# Altium schematic sheet TopLevel.SchDoc: Titel
size A3; ApprovedBy: name; CompanyName: DCI Electronics bv; DrawnBy: KRS; Address1: Nijverheidsstraat 14; Address2: 4458 AV Eindewege; Address3: Phone: +31 (0)113 344880; DocumentNumber: 2; Revision: 1; SheetNumber: 2; SheetTotal: 14; PageSetup: Record=PageOptions|CenterHorizontal=True|CenterVertical=True|PrintScale=1.00|XCorrection=1.00|YCorrection=1.00|PrintKind=1|BorderSize=5000000|LeftOffset=0|BottomOffset=0|Orientation=2|PaperLength=1000|PaperWidth=1000|Scale=100|PaperSource=7|PrintQuality=-4|MediaType=1|DitherType=10|PaperKind=ISO_A4_(210.00_x_297.00_MM)|PrintScaleMode=1; SubTitle: SubTitel; ApprovedDate: 01-01-12
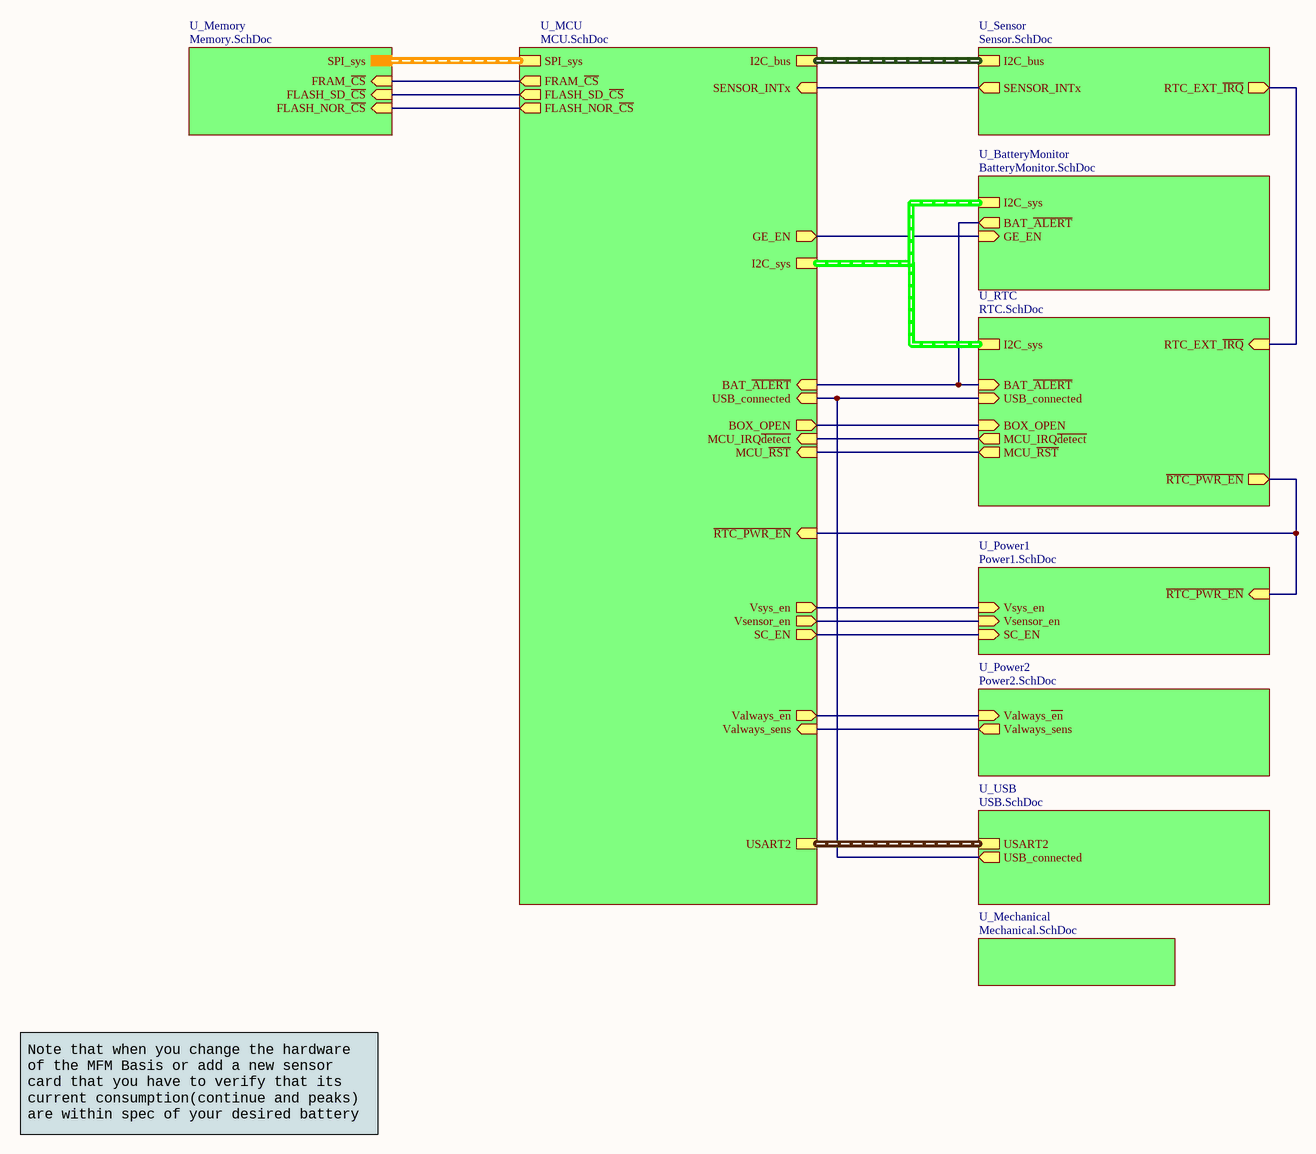
[diagram p0: TopLevel.SchDoc]

## Sub-sheets
U_BatteryMonitor = BatteryMonitor.SchDoc: BAT_~{ALERT} (out), I2C_sys (harness I2C), GE_EN (in)
U_MCU = MCU.SchDoc: MCU_~{RST} (in), SPI_sys (harness SPI), I2C_sys (harness I2C), I2C_bus (harness I2C), USART2 (harness UART), Vsensor_en (out), Vsys_en (out), FRAM_~{CS} (out), FLASH_SD_~{CS} (out), FLASH_NOR_~{CS} (out), MCU_IRQ~{detect} (in), USB_connected (in), SENSOR_INTx (in), Valways_~{en} (out), BAT_~{ALERT} (in), ~{RTC_PWR_EN} (in), SC_EN (out), GE_EN (out), Valways_sens (in), BOX_OPEN (out)
U_Mechanical = Mechanical.SchDoc: no entries
U_Memory = Memory.SchDoc: SPI_sys (harness SPI), FRAM_~{CS} (in), FLASH_SD_~{CS} (in), FLASH_NOR_~{CS} (in)
U_Power1 = Power1.SchDoc: Vsys_en (in), Vsensor_en (in), ~{RTC_PWR_EN} (in), SC_EN (in)
U_Power2 = Power2.SchDoc: Valways_~{en} (in), Valways_sens (out)
U_RTC = RTC.SchDoc: I2C_sys (harness I2C), ~{RTC_PWR_EN} (out), MCU_~{RST} (out), MCU_IRQ~{detect} (out), USB_connected (in), BAT_~{ALERT} (in), BOX_OPEN (in), RTC_EXT_~{IRQ} (in)
U_Sensor = Sensor.SchDoc: I2C_bus (harness I2C), RTC_EXT_~{IRQ} (out), SENSOR_INTx (out)
U_USB = USB.SchDoc: USB_connected (out), USART2 (harness UART)

## Nets
(unnamed): sheet U_MCU/MCU_~{RST}, sheet U_RTC/MCU_~{RST}
(unnamed): sheet U_MCU/Vsensor_en, sheet U_Power1/Vsensor_en
(unnamed): sheet U_MCU/Vsys_en, sheet U_Power1/Vsys_en
(unnamed): sheet U_MCU/FRAM_~{CS}, sheet U_Memory/FRAM_~{CS}
(unnamed): sheet U_MCU/FLASH_SD_~{CS}, sheet U_Memory/FLASH_SD_~{CS}
(unnamed): sheet U_MCU/FLASH_NOR_~{CS}, sheet U_Memory/FLASH_NOR_~{CS}
(unnamed): sheet U_MCU/MCU_IRQ~{detect}, sheet U_RTC/MCU_IRQ~{detect}
(unnamed): sheet U_MCU/USB_connected, sheet U_RTC/USB_connected, sheet U_USB/USB_connected
(unnamed): sheet U_MCU/SENSOR_INTx, sheet U_Sensor/SENSOR_INTx
(unnamed): sheet U_MCU/Valways_~{en}, sheet U_Power2/Valways_~{en}
(unnamed): sheet U_MCU/BAT_~{ALERT}, sheet U_BatteryMonitor/BAT_~{ALERT}, sheet U_RTC/BAT_~{ALERT}
(unnamed): sheet U_MCU/~{RTC_PWR_EN}, sheet U_RTC/~{RTC_PWR_EN}, sheet U_Power1/~{RTC_PWR_EN}
(unnamed): sheet U_MCU/SC_EN, sheet U_Power1/SC_EN
(unnamed): sheet U_MCU/GE_EN, sheet U_BatteryMonitor/GE_EN
(unnamed): sheet U_MCU/Valways_sens, sheet U_Power2/Valways_sens
(unnamed): sheet U_MCU/BOX_OPEN, sheet U_RTC/BOX_OPEN
(unnamed): sheet U_Sensor/RTC_EXT_~{IRQ}, sheet U_RTC/RTC_EXT_~{IRQ}

## Buses and harness runs
harness sheet U_BatteryMonitor/I2C_sys = sheet U_MCU/I2C_sys = sheet U_RTC/I2C_sys
harness sheet U_MCU/I2C_bus = sheet U_Sensor/I2C_bus
harness sheet U_MCU/SPI_sys = sheet U_Memory/SPI_sys
harness sheet U_MCU/USART2 = sheet U_USB/USART2

## Notes on the sheet
- Note that when you change the hardware of the MFM Basis or add a new sensor card that you have to verify that its current consumption(continue and peaks) are within spec of your desired battery
- Designed by:
- Drawing number:
- Variant:
- Date:
- Page:
- Rev:
- Of:
- Dekimo Goes B.V.
- Nijverheidsstraat 14, 4458 AV  Eindewege, Phone: +31 (0)113 344880